# Altium schematic sheet EEPROM_and_Actuator.SchDoc
size A4
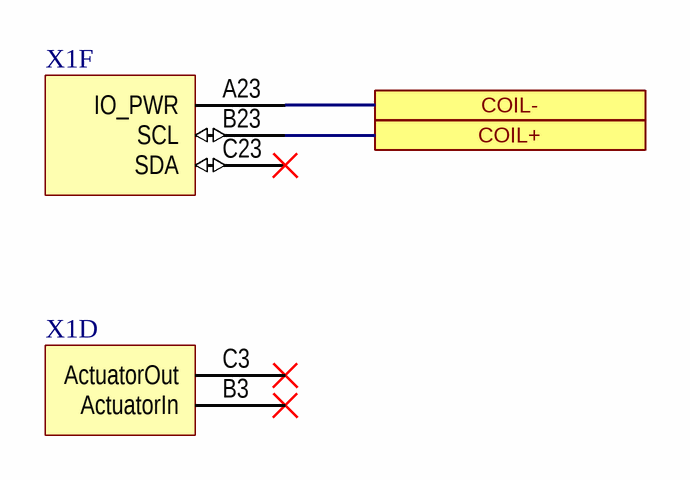
[diagram p0: EEPROM_and_Actuator.SchDoc]

## Parts
X1  09731966907  [09731966907]  (value not drawn)  (parts D,F of 8)

## Ports
COIL+ (harness VC), COIL- (harness VC)

## Nets

Not connected (* = marked no-connect by the designer): X1 A23(IO_PWR) B3(ActuatorIn)* B23(SCL) C3(ActuatorOut)* C23(SDA)*

## Notes on the sheet
- designed by
- reviewed by
- last drawn by
- Workspace:
- Altium Rev.:
- Project:
- Schematic:
- last printed
- DIN-A4 L
- Rev.
- sheets
- of
- File:

## Library data of the parts
X1 = MiniSCT8: 96 Position Din Connector Header, Male Pins Gold or Gold-Palladium Through Hole; Manufacturer: Harting; Manufacturer Part Number: 09731966907; ComponentLink1Description: Datasheet; ComponentLink1URL: https://b2b.harting.com/files/download/PRD/PDF_DS/09731100001_100560208DRW001D.pdf; ComponentLink2Description: Reference; ComponentLink2URL: https://www.digikey.de/products/en?keywords=09731966907; Supplier 1: Digi-Key; Supplier Part Number 1: 1195-5217-ND